# Altium schematic sheet Sheet3.SchDoc
size 299 x 190 mm; SheetNumber: 1; SheetTotal: 2
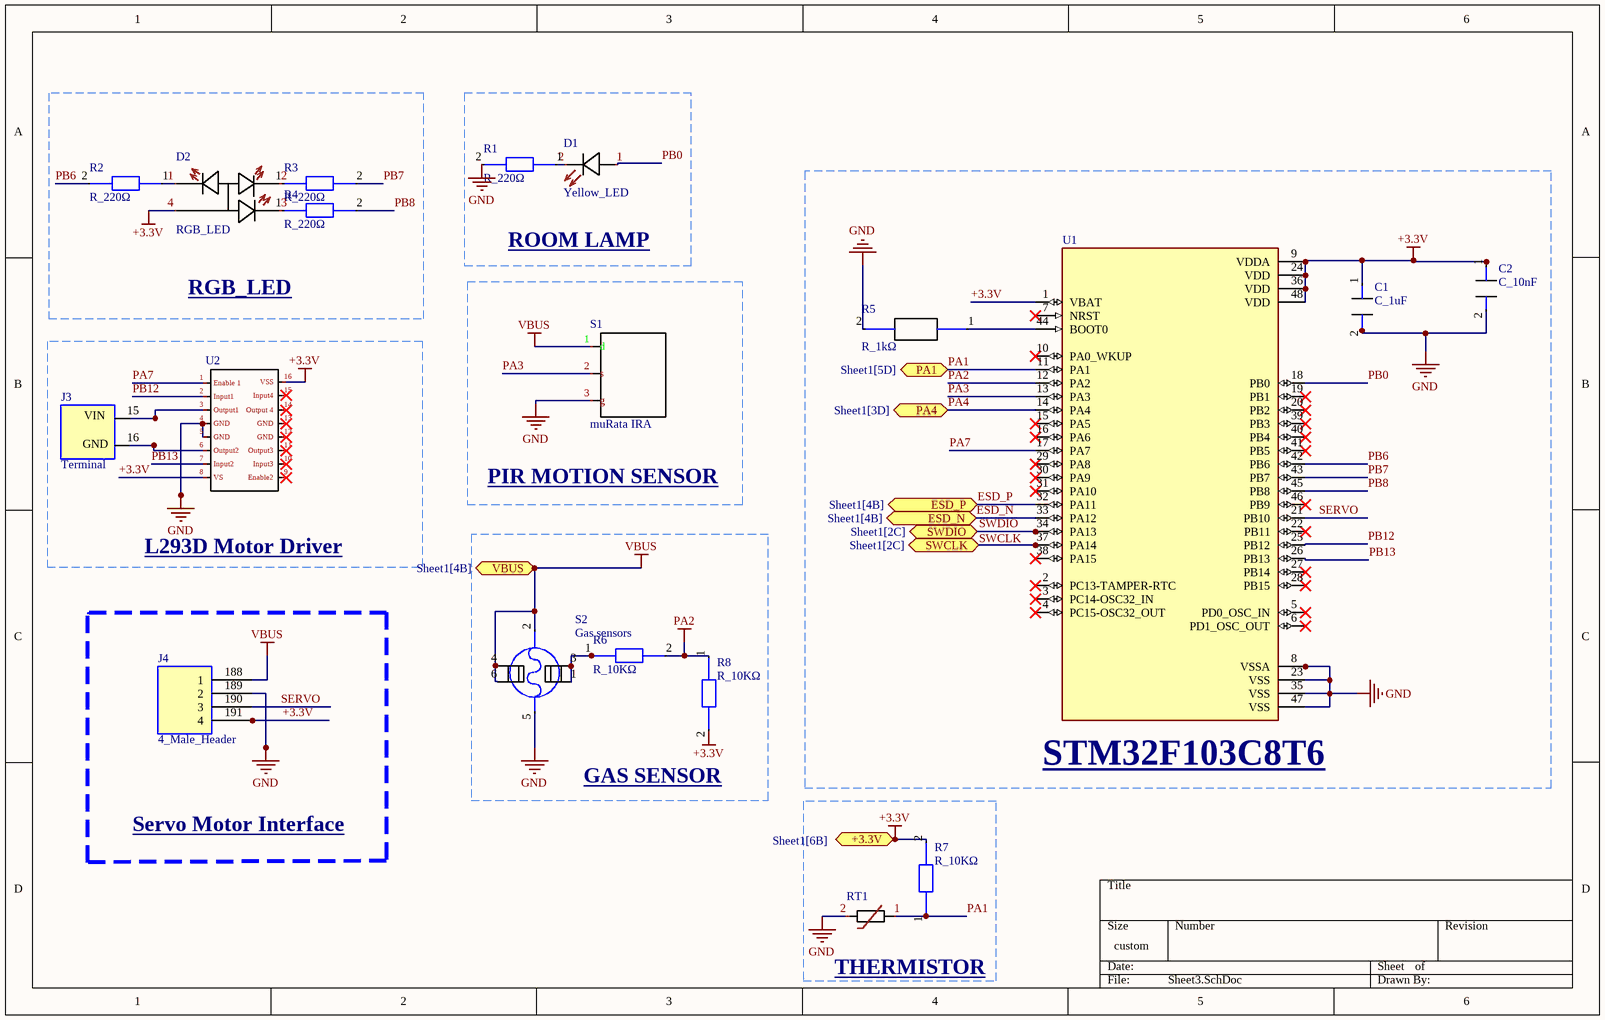
[diagram p0: Sheet3.SchDoc]

## Parts
C1  C_1uF  [CAP_1uF]
C2  C_10nF  [CAP_10nF]
D1  Yellow_LED  [LED_YELLOW]
D2  RGB_LED  [RGB_LED]
J3  Terminal  [Terminal Block]
J4  4_Male_Header  [4_MALE_HEADER]
R1  R_220Ω  [RES_220]
R2  R_220Ω  [RES_220]
R3  R_220Ω  [RES_220]
R4  R_220Ω  [RES_220]
R5  R_1kΩ  [RES_1K]
R6  R_10KΩ  [RES_10K]
R7  R_10KΩ  [RES_10K]
R8  R_10KΩ  [RES_10K]
RT1  THERMISTOR  [NTC_THERMISTOR]
S1  muRata IRA  [OPTICAL_SENSOR]
S2  Gas sensors  [GAS_SENSOR]
U1  STM32F103C8T6  [STM32]
U2  L293D Motor Driver  [L293D]

## Blocks framed on the sheet
RGB_LED: D2 R2-R4
ROOM LAMP: D1 R1
PIR MOTION SENSOR: S1
GAS SENSOR: R6 R8 S2
Servo Motor Interface: J4

## Ports
+3.3V (bidir, see Sheet1[6B]), ESD_N (bidir, see Sheet1[4B]), ESD_P (bidir, see Sheet1[4B]), PA1 (bidir, see Sheet1[5D]), PA4 (bidir, see Sheet1[3D]), SWCLK (bidir, see Sheet1[2C]), SWDIO (bidir, see Sheet1[2C]), VBUS (bidir, see Sheet1[4B])

## Nets
+3.3V: C1.1 C2.1 D2.4 J4.191(4) R7.2 R8.2 U1.1(VBAT) U1.9(VDDA) U1.24(VDD) U1.36(VDD) U1.48(VDD) U2.8(VS) U2.16(VSS) ; port +3.3V
GND: C1.2 C2.2 J4.189(2) R1.2 R5.2 RT1.2 S1.3(g) S2.5 U1.8(VSSA) U1.23(VSS) U1.35(VSS) U1.47(VSS) U2.4(GND) U2.5(GND)
PA2: R6.2 R8.1 U1.12(PA2)
VBUS: J4.188(1) S1.1(d) S2.2 S2.4 S2.6 ; port VBUS
ESD_N: U1.33(PA12) ; port ESD_N
ESD_P: U1.32(PA11) ; port ESD_P
PA1: R7.1 RT1.1 U1.11(PA1) ; port PA1
PA3: S1.2(s) U1.13(PA3)
PA4: U1.14(PA4) ; port PA4
PA7: U1.17(PA7) U2.1(Enable_1)
PB0: D1.1 U1.18(PB0)
PB6: R2.2 U1.42(PB6)
PB7: R3.2 U1.43(PB7)
PB8: R4.2 U1.45(PB8)
PB12: U1.25(PB12) U2.2(Input1)
PB13: U1.26(PB13) U2.7(Input2)
SERVO: J4.190(3) U1.21(PB10)
SWCLK: U1.37(PA14) ; port SWCLK
SWDIO: U1.34(PA13) ; port SWDIO
NetD1_2: D1.2 R1.1
NetD2_1: D2.1 R2.1
NetD2_2: D2.2 R3.1
NetD2_3: D2.3 R4.1
NetJ3_15: J3.15 U2.3(Output1)
NetJ3_16: J3.16 U2.6(Output2)
NetR5_1: R5.1 U1.44(BOOT0)
NetR6_1: R6.1 S2.1 S2.3

Not connected (* = marked no-connect by the designer): U1 2(PC13-TAMPER-RTC)* 3(PC14-OSC32_IN)* 4(PC15-OSC32_OUT)* 5(PD0_OSC_IN)* 6(PD1_OSC_OUT)* 7(NRST)* 10(PA0_WKUP)* 15(PA5)* 16(PA6)* 19(PB1)* 20(PB2)* 22(PB11)* 27(PB14)* 28(PB15)* 29(PA8)* 30(PA9)* 31(PA10)* 38(PA15)* 39(PB3)* 40(PB4)* 41(PB5)* 46(PB9)*; U2 9(Enable2)* 10(Input3)* 11(Output3)* 12(GND)* 13(GND)* 14(Output_4)* 15(Input4)*

## Notes on the sheet
- Labels drawn without touching a wire or pin: SWCLK
- (in symbol Terminal) VIN; GND

## Library data of the parts
C1 = C_1uF: CAP CER 1uF 50V X7R 0805; MFR: Samsung Electro-Mechanics; MFR Part #: CL21B105KBFNNNE; Supplier: LCSC; Supplier Part #: C28323; ComponentLink1Description: Supplier Part Page; ComponentLink1URL: https://www.lcsc.com/product-detail/C28323.html?s_z=n_q_t_capacitor%25201uF%25200805&spm=wm.fly.bg.0.xh___wm.ssy.tc.0.tz&lcsc_vid=RVdfAQAHTlQNBQIDRgNYVAdUQ1hWXlBRQ1kLVlcDRVkxVlNeQFNcUlVTRVdZXjsOAxUeFF5JWBYZEEoKFBINSQcJGk4NBhADEA4cHktXRlVcSQwSGg0%3D
C2 = C_10nF: CAP CER 10nF 50V X7R 0805; MFR: Samsung Electro-Mechanics; MFR part#: CL21B103KBANNNC; Supplier: LCSC; Suppliere part #: C1710; ComponentLink1Description: Datasheet; ComponentLink1URL: https://www.lcsc.com/datasheet/C1710.pdf?spm=wm.sxq.inf.ggs___wm.fly.bg.0.xh&lcsc_vid=E1EMUFFTQQILUVRVRlhaUAYEQ1RWA1RTFlhWXwYAQlkxVlNeT1hWUldWT1NZUDsOAxUeFF5JWBYZEEoKFBINSQcJGk4dAgUUFAk%3D
D1 = Yellow_LED: LED YELLOW GREEN 0805 SMD; MFU: YONGYUTAI; MFU code #: YLED0805YG; Supplier: LCSC; Supplier code #: C19171393; ComponentLink1Description: Datasheet; ComponentLink1URL: https://www.lcsc.com/datasheet/C19171393.pdf?spm=wm.sxq.inf.ggs___wm.fly.bg.6.xh&lcsc_vid=E1EMUFFTQQILUVRVRlhaUAYEQ1RWA1RTFlhWXwYAQlkxVlNeT1JYU1JRRFhbVTsOAxUeFF5JWBYZEEoKFBINSQcJGk4dAgUUFAk%3D
D2 = RGB_LED: 120° SMD-4P,2x1.2mm LED Indication - Discrete; MPN: MHT170RGBCT; MF: MEIHUA; Supplier: LCSC; Supplier part #: C2962094; ComponentLink1Description: Datasheet; ComponentLink1URL: https://www.lcsc.com/datasheet/C2962094.pdf?spm=wm.sxq.inf.ggs&lcsc_vid=EwQNUwAFEwJeBFwCQlANU10CTwBcVlBTFAMMV1FeQFkxVlNeT1deXlFfQlVbVztW
J3 = Terminal: 0.05~1.3 -40℃~+110℃ 13.5A 1x2P Green 16~30 Through Hole 2 1 5.08mm Through Hole Wire to Board RoHS; MFR: TE Connectivity; MFR Part #: 282837-2; Supplier: LCSC; Supplier Part #: C592976; ComponentLink1Description: Supplier Page Link; ComponentLink1URL: https://www.lcsc.com/product-detail/C592976.html?s_z=n_q_282837-2&spm=wm.fly.bg.0.xh&lcsc_vid=RVdfAQAHTlQNBQIDRgNYVAdUQ1hWXlBRQ1kLVlcDRVkxVlNeQVVbUVJXT1RdUTsOAxUeFF5JWBYZEEoKFBINSQcJGk4NBhADEA4cHkteQ1NADxALGw%3D%3D
J4 = 4_Male_Header: PCB Mount Header, Vertical, Wire-to-Board, 4 Position, 2.54 mm Centerline, Partially Shrouded, Gold, Through Hole - Solder, Signal; MFR: TE Connectivity; MFR Part #: 3-641215-4; Supplier: LCSC; Supplier Part #: C5119032; ComponentLink1Description: Supplier Part Page; ComponentLink1URL: https://www.lcsc.com/product-detail/C5119032.html?s_z=n_q_3-641215-4&spm=wm.fly.bg.0.xh&lcsc_vid=RVdfAQAHTlQNBQIDRgNYVAdUQ1hWXlBRQ1kLVlcDRVkxVlNeQFNcX1FURVRaVzsOAxUeFF5JWBYZEEoKFBINSQcJGk4dAgUUFAk%3D
R1-R4 = R_220Ω: RES 220Ω ±1% 125mW 0805; MFR: UNI-ROYAL; MFR Part #: 0805W8F2200T5E; Supplier: LCSC; Supplier Part #: C17557; ComponentLink1Description: Supplier Part Page; ComponentLink1URL: https://www.lcsc.com/product-detail/C17557.html?s_z=n_q_resistor%2520220%2520ohm%25200805&spm=wm.fly.bg.0.xh&lcsc_vid=RVdfAQAHTlQNBQIDRgNYVAdUQ1hWXlBRQ1kLVlcDRVkxVlNeQFBaUVdQRVVeUDsOAxUeFF5JWBYZEEoKFBINSQcJGk4eFQsCAgIaSgADAwAHC0slQFRfXkoOAwwC
R5 = R_1kΩ: RES 1kΩ ±1% 100mW 0805; MFU part #: FRC0603F1001TS; MFU: FOJAN; Supplier: LCSC; Supplier part #: C2907002; ComponentLink1Description: Datasheet; ComponentLink1URL: https://www.lcsc.com/datasheet/C2907002.pdf?spm=wm.sxq.inf.ggs___wm.fly.bg.3.xh&lcsc_vid=QAQMVlZTQQVfVwJVQgNaVAUDRlAKAlQCTwJdAQVSRFgxVlNeQVZcVl1fTlhaUjsOAxUeFF5JWBYZEEoEHg8JSQcJGk4%3D
R6-R8 = R_10KΩ: RES 10kΩ ±1% 125mW 0805; MFR: FOJAN; MFR Part #: FRC0805F1002TS; Supplier: LCSC; Supplier Part #: C2907219; ComponentLink1Description: Supplier Part Page; ComponentLink1URL: https://www.lcsc.com/product-detail/C2907219.html?s_z=n_q_p_resistor%252010K%2520ohm%25200805&spm=wm.ssy.bg.0.xh&lcsc_vid=RVdfAQAHTlQNBQIDRgNYVAdUQ1hWXlBRQ1kLVlcDRVkxVlNeQFBaUVNST1NfVjsOAxUeFF5JWBYZEEoKFBINSQcJGk4dAgUUFAk%3D
RT1 = THERMISTOR: THERMISTOR NTC 10kΩ 3950K 0805; MPN #: KNTC0805/10KF3950; MF: KUU; Supplier: LCSC; Supplier part #: C2892549; ComponentLink1Description: Datasheet; ComponentLink1URL: https://www.lcsc.com/datasheet/C2892549.pdf?spm=wm.sxq.inf.ggs___wm.fly.bg.2.xh&lcsc_vid=E1EMUFFTQQILUVRVRlhaUAYEQ1RWA1RTFlhWXwYAQlkxVlNeT1JYVV1fQVFWVzsOAxUeFF5JWBYZEEoKFBINSQcJGk4%3D
S1 = muRata IRA: Through Hole Optical Motion Sensors RoHS; MPN: IRA-S210ST01; MF: muRata; Supplier: LCSC; Supplier Part #: C152563; ComponentLink1Description: Datasheet; ComponentLink1URL: https://www.lcsc.com/datasheet/C152563.pdf?spm=wm.sxq.inf.ggs___wm.fly.bg.0.xh&lcsc_vid=E1EMUFFTQQILUVRVRlhaUAYEQ1RWA1RTFlhWXwYAQlkxVlNeT1JYVFZXRVhcUDsOAxUeFF5JWBYZEEoKFBINSQcJGk4dAgUUFAk%3D
S2 = Gas sensors: 300ppm~10000ppm Through Hole Gas Sensors; MPN: MQ-5; MF: Zhengzhou Winsen Elec Tech; Supplier: LCSC; Supplier Part #: C99297; ComponentLink1Description: Datasheet; ComponentLink1URL: https://www.lcsc.com/datasheet/C99297.pdf?spm=wm.sxq.inf.ggs___wm.ssy.em.0.tz&lcsc_vid=E1EMUFFTQQILUVRVRlhaUAYEQ1RWA1RTFlhWXwYAQlkxVlNeT1JYVF1QQ1ZWUjsOAxUeFF5JWBYZEEoKFBINSQcJGk4eFQsCAgIaSgADAwAHC0slQ1NaVFVeQVZADxALGw%3D%3D
U1 = STM32F103C8T6: -40℃~+85℃ 12bit 20KB 2V~3.6V 32 Bit 37 64KB 72MHz ARM Cortex-M3 Built-in FLASH LQFP-48(7x7) Microcontrollers (MCU/MPU/SOC) ROHS; MF: STMicroelectronics; MFR PART #: STMicroelectronics; Supplier: JLCPCB; Supplier Part #: C8734; ComponentLink1Description: Datasheet; ComponentLink1URL: https://jlc-prod-smt.oss-eu-central-1.aliyuncs.com/smtDataManualFile/8579708215770480640-C8734.pdf?response-content-disposition=attachment%3B%20filename%3DC8734.pdf%3B%20filename%2A%3DUTF-8%27%27C8734.pdf&x-oss-date=20260822T112136Z&x-oss-expires=1800&x-oss-security-token=CAISgAN1q6Ft5B2yfSjIr5r9HuPMuopW9JKdbW3Sg0MBbvdkhped1jz2IHhMdHJsAOodtv0%2FmmhT6PkclqRLcbhpcmfjV%2BZHzLB8qf5B%2Bykr557b16cNrbH4M4H6aXeirtuwDsz9SNTCALjPD3nPii50x5bjaDymRCbLGJaViJlhHLN1Ow6jdmhpCctxLAlvo9NgFxm3D%2Fu2NQPwiWf9FVdhvhEG6Vly8qOi2MaRmFy8yFTx0b0SvJ%2BjYMrmPctoN9JnSdC5mfdzau3a1TJ84gRD0a5wkaVA1zbDs5bfISEIuUzebreLqY03dV4mOvdqIcMe8qigz88fk%2FfIioH6xyxKOexoSCnFTOiiupCcQLPyao9jLu6iayqViY7QaIOTqQohZmkAMwVOasAsI3Ngh4zF97Qt0cVNkXO9gWfLI8DtuMleWmpnyfoJs6HD0eS19jklBdzSlusJRAJJUVBflCeKEaRNSAd3WGhEfM2%2BBt4QT30w5N2u00S8OSMILh50ZKKWD5sagAERxjOFVQunN%2FMP%2B4pPj192lIv%2Fb%2FBhYoH1dXybskWmVsGIA0U6FIyufmkP83RoZanjtyEj%2FMYM6ZCoxn9wNR1FUWyys6LeuQiyfFaBwd42eAW9cxY8QGfZwYhiboSH%2Bd%2FHYxRsYJhTEvCPbbJHyAklPAFDR4R0AEccKLctMzybhSAA&x-oss-signature-version=OSS4-HMAC-SHA256&x-oss-credential=STS.NYHUYxWUwCPvoKcgCTbxHiR64%2F20260822%2Feu-central-1%2Foss%2Faliyun_v4_request&x-oss-signature=046f7eb699a18f694d803c947e8fbc0a7e9770749a7982aa4ec2455890b0bf02
U2 = L293D Motor Driver: PUSH-PULL FOUR CHANNEL DRIVER WITH DIODES; MFR: HGSEMI; MRF Part #: L293DDM/TR; Supplier: LCSC; Supplier Part #: C2973803; ComponentLink1Description: Datasheet; ComponentLink1URL: https://www.lcsc.com/datasheet/C2973803.pdf?spm=wm.sxq.inf.ggs___wm.fly.bg.1.xh&lcsc_vid=E1EMUFFTQQILUVRVRlhaUAYEQ1RWA1RTFlhWXwYAQlkxVlNeT1hZUFxVT1RXVzsOAxUeFF5JWBYZEEoKFBINSQcJGk4%3D